# EAGLE design PCB-BI8-SE-C330 (EAGLE 6.4)
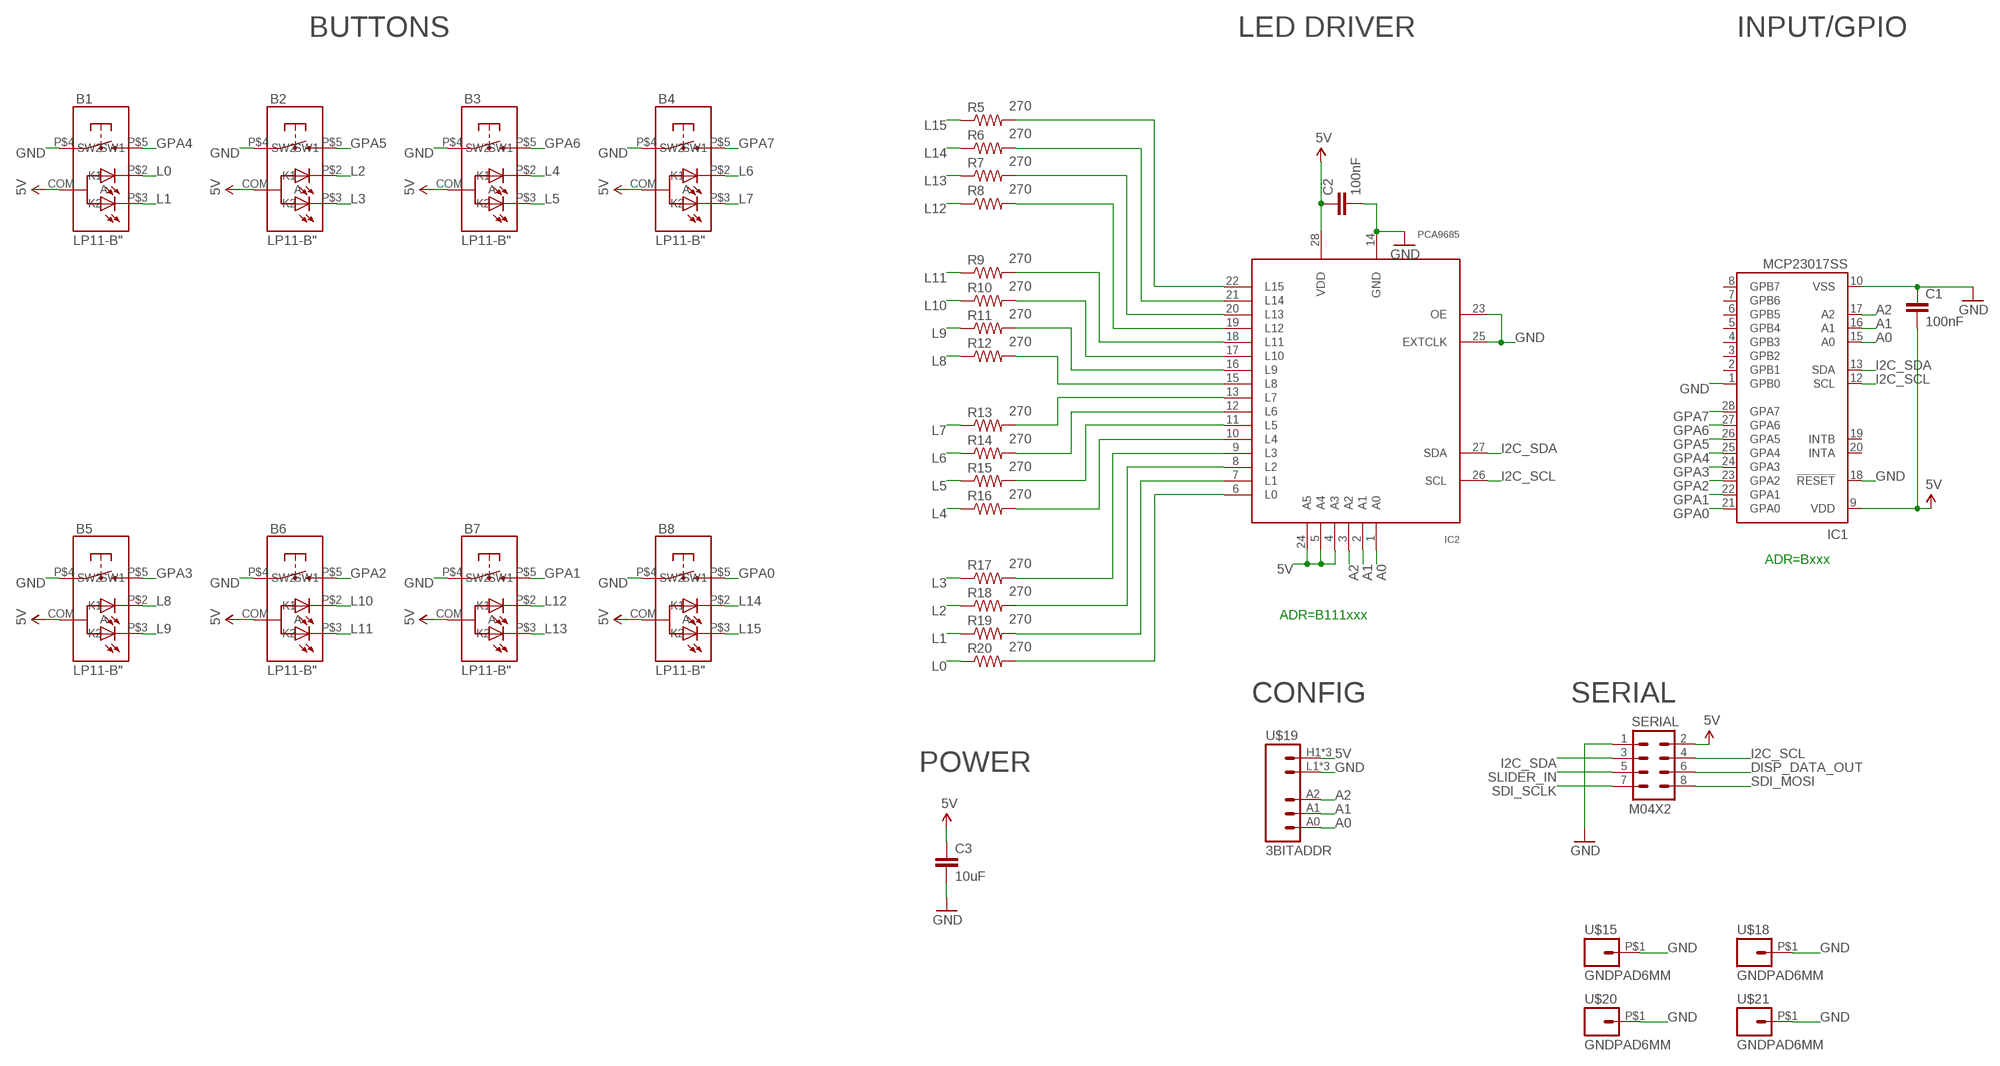
[diagram p0: schematic, sheet 1]

## Parts
B1  LP11-B"  [LP11]
B2  LP11-B"  [LP11]
B3  LP11-B"  [LP11]
B4  LP11-B"  [LP11]
B5  LP11-B"  [LP11]
B6  LP11-B"  [LP11]
B7  LP11-B"  [LP11]
B8  LP11-B"  [LP11]
C1  100nF  CAP0603-CAP  [0603-CAP]
C2  100nF  CAP0603-CAP  [0603-CAP]
C3  10uF  CAP0805  [0805]
IC1  MCP23017SS  [SSOP28]
IC2  PCA9685  [TSSOP28]
R5  270  RESISTOR0603-RES  [0603-RES]
R6  270  RESISTOR0603-RES  [0603-RES]
R7  270  RESISTOR0603-RES  [0603-RES]
R8  270  RESISTOR0603-RES  [0603-RES]
R9  270  RESISTOR0603-RES  [0603-RES]
R10  270  RESISTOR0603-RES  [0603-RES]
R11  270  RESISTOR0603-RES  [0603-RES]
R12  270  RESISTOR0603-RES  [0603-RES]
R13  270  RESISTOR0603-RES  [0603-RES]
R14  270  RESISTOR0603-RES  [0603-RES]
R15  270  RESISTOR0603-RES  [0603-RES]
R16  270  RESISTOR0603-RES  [0603-RES]
R17  270  RESISTOR0603-RES  [0603-RES]
R18  270  RESISTOR0603-RES  [0603-RES]
R19  270  RESISTOR0603-RES  [0603-RES]
R20  270  RESISTOR0603-RES  [0603-RES]
SERIAL  M04X2  [2X4]
U$15  GNDPAD6MM  [3.2MMPAD6MM]
U$18  GNDPAD6MM  [3.2MMPAD6MM]
U$19  3BITADDR  [3BITADDR]
U$20  GNDPAD6MM  [3.2MMPAD6MM]
U$21  GNDPAD6MM  [3.2MMPAD6MM]

## Nets
5V [Power]: B1.COM(A) B2.COM(A) B3.COM(A) B4.COM(A) B5.COM(A) B6.COM(A) B7.COM(A) B8.COM(A) C1.2 C2.1 C3.1 IC1.9(VDD) IC2.4(A3) IC2.5(A4) IC2.24(A5) IC2.28(VDD) SERIAL.2 U$19.H1(VCC) U$19.H2(VCC) U$19.H3(VCC)
A0: IC1.15(A0) IC2.1(A0) U$19.A0
A1: IC1.16(A1) IC2.2(A1) U$19.A1
A2: IC1.17(A2) IC2.3(A2) U$19.A2
DISP_DATA_OUT: SERIAL.6
GND [Power]: B1.P$4(SW1) B2.P$4(SW1) B3.P$4(SW1) B4.P$4(SW1) B5.P$4(SW1) B6.P$4(SW1) B7.P$4(SW1) B8.P$4(SW1) C1.1 C2.2 C3.2 IC1.1(GPB0) IC1.10(VSS) IC1.18(!RESET) IC2.14(GND) IC2.23(OE) IC2.25(EXTCLK) SERIAL.1 U$15.P$1 U$18.P$1 U$19.L1(GND) U$19.L2(GND) U$19.L3(GND) U$20.P$1 U$21.P$1
GPA0: B8.P$5(SW2) IC1.21(GPA0)
GPA1: B7.P$5(SW2) IC1.22(GPA1)
GPA2: B6.P$5(SW2) IC1.23(GPA2)
GPA3: B5.P$5(SW2) IC1.24(GPA3)
GPA4: B1.P$5(SW2) IC1.25(GPA4)
GPA5: B2.P$5(SW2) IC1.26(GPA5)
GPA6: B3.P$5(SW2) IC1.27(GPA6)
GPA7: B4.P$5(SW2) IC1.28(GPA7)
I2C_SCL: IC1.12(SCL) IC2.26(SCL) SERIAL.4
I2C_SDA: IC1.13(SDA) IC2.27(SDA) SERIAL.3
L0: B1.P$2(K1) R20.1
L1: B1.P$3(K2) R19.1
L2: B2.P$2(K1) R18.1
L3: B2.P$3(K2) R17.1
L4: B3.P$2(K1) R16.1
L5: B3.P$3(K2) R15.1
L6: B4.P$2(K1) R14.1
L7: B4.P$3(K2) R13.1
L8: B5.P$2(K1) R12.1
L9: B5.P$3(K2) R11.1
L10: B6.P$2(K1) R10.1
L11: B6.P$3(K2) R9.1
L12: B7.P$2(K1) R8.1
L13: B7.P$3(K2) R7.1
L14: B8.P$2(K1) R6.1
L15: B8.P$3(K2) R5.1
N$4: IC2.13(L7) R13.2
N$5: IC2.12(L6) R14.2
N$7: IC2.11(L5) R15.2
N$9: IC2.10(L4) R16.2
N$10: IC2.9(L3) R17.2
N$11: IC2.8(L2) R18.2
N$12: IC2.7(L1) R19.2
N$19: IC2.6(L0) R20.2
N$20: IC2.15(L8) R12.2
N$21: IC2.16(L9) R11.2
N$22: IC2.17(L10) R10.2
N$23: IC2.18(L11) R9.2
N$24: IC2.19(L12) R8.2
N$25: IC2.20(L13) R7.2
N$26: IC2.21(L14) R6.2
N$27: IC2.22(L15) R5.2
SDI_MOSI: SERIAL.8
SDI_SCLK: SERIAL.7
SLIDER_IN: SERIAL.5
Unconnected: IC1.2(GPB1) IC1.3(GPB2) IC1.4(GPB3) IC1.5(GPB4) IC1.6(GPB5) IC1.7(GPB6) IC1.8(GPB7) IC1.19(INTB) IC1.20(INTA)

## Notes on the sheet
- BUTTONS | LED DRIVER | INPUT/GPIO
- ADR=Bxxx
- ADR=B111xxx
- CONFIG | SERIAL
- POWER

## Library data of the parts
B1-B8 = SKAARHOJ:LP11-B
C1-C3 = SparkFun:CAP: Capacitor Standard 0603 ceramic capacitor, and 0.1" leaded capacitor.
IC1 = microchip:MCP23017: http://ww1.microchip.com/downloads/en/DeviceDoc/21952a.pdf Source: http://ww1.microchip.com/downloads/en/DeviceDoc/21952a.pdf; MF: MICROCHIP; MPN: MCP23017-E/SS; OC_FARNELL: 1467674; OC_NEWARK: 31K2960
IC2 = wsmith:PCA9685
R5-R20 = SparkFun:RESISTOR: Resistor Basic schematic elements and footprints for 0603, 1206, and PTH resistors.
SERIAL = SparkFun:M04X2
U$15 U$18 U$20 U$21 = SKAARHOJ:GNDPAD
U$19 = SKAARHOJ:3BITADDR

## Net classes
0 default: width 0.203 mm, drill 0.406 mm, clearance 0.203 mm
1 Power: width 0.406 mm, drill 0.61 mm, clearance 0.203 mm

## Board
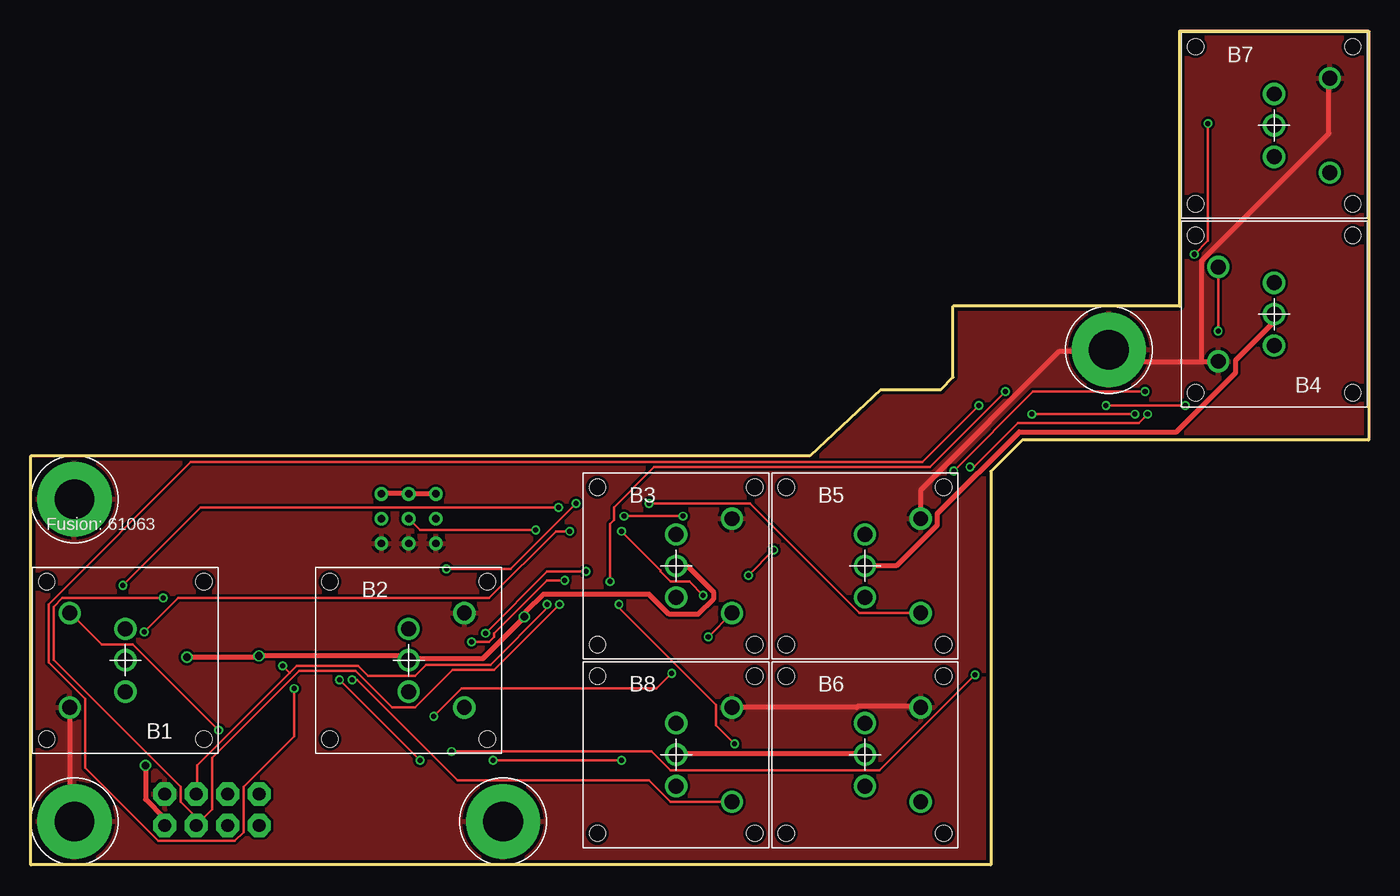
[diagram p1: board, top side]
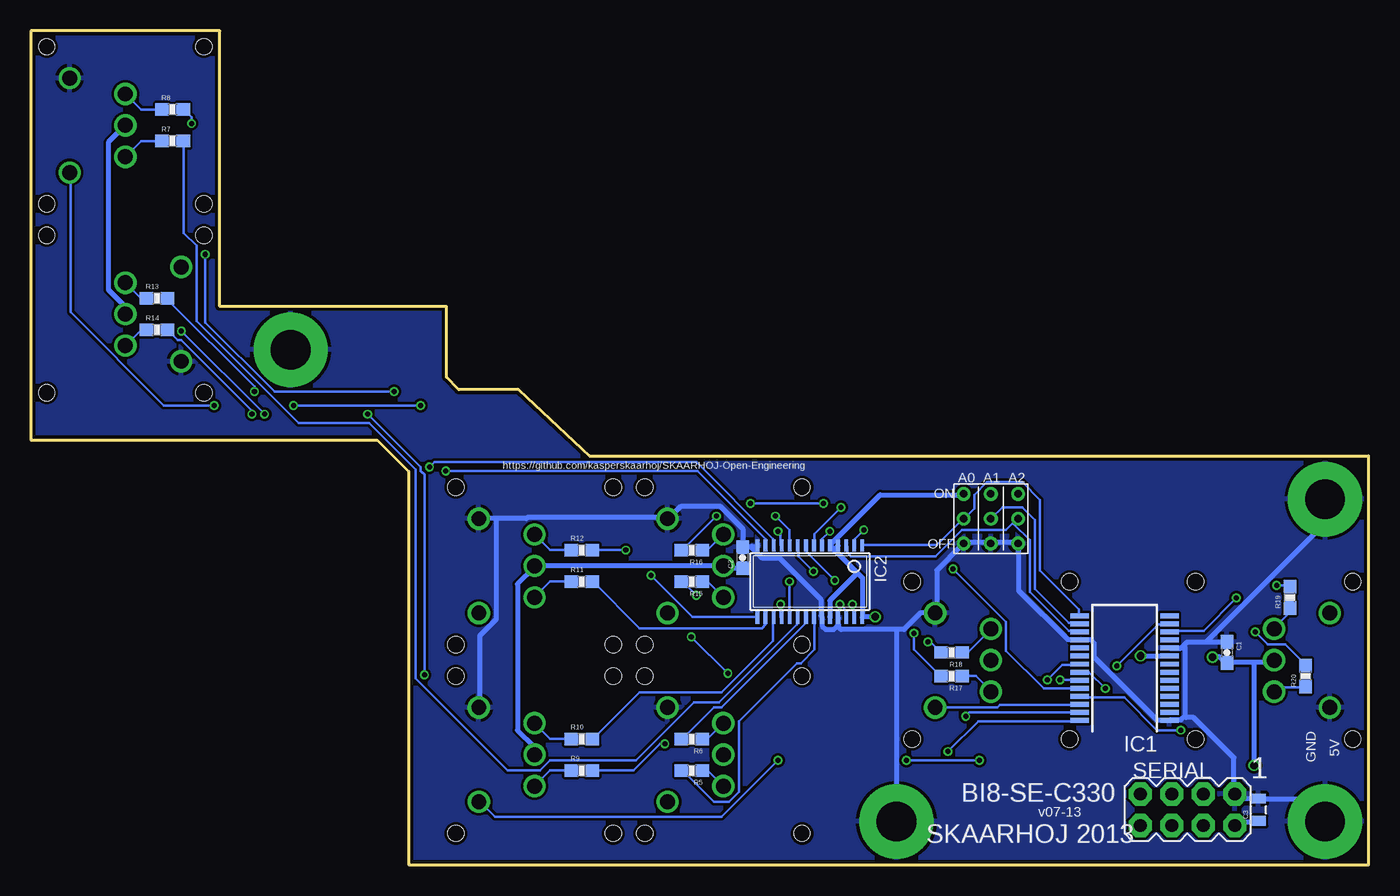
[diagram p2: board, bottom side, seen from below]

Size 107.95 x 67.31 mm. Coordinates in mm from the lower left corner, seen from the top.
Outline: 0,0 0,33.02 62.87,33.02 68.58,38.35 73.43,38.35 74.42,39.37 74.42,45.09 92.71,45.09 92.71,67.31 107.95,67.31 107.95,34.29 80.01,34.29 77.47,31.75 77.47,0 0,0
Copper layers (1*16): Top 0.035mm / dielectric 1.5mm / Bottom 0.035mm
Design rules "Fusion_eagle_rule_v1.1": minimum track width 6mil, minimum drill 12mil, track to track 6mil, track to pad 6mil, pad to pad 6mil, via to via 6mil, smd to smd 0mil, copper to edge 10mil, drill to drill 10mil, minimum pad ring 10mil, minimum via ring 6mil, stop-mask expansion 2mil, vias tented up to drill 100mil, thermal gap 10mil

### Footprints (pad centres in the part's own frame; a part is rotated, then mirrored left to right if it is on the bottom)
LP11 = drill 1.2: COM 0,0; P$2 0,2.54; P$3 0,-2.54; P$4 4.5,3.81; P$5 4.5,-3.81 | hole 1.3: -6.35,6.35; 6.35,6.35; 6.35,-6.35; -6.35,-6.35
0603-CAP = smd 1.1 x 1: 1 -0.85,0; 2 0.85,0
0805 = smd 0.8 x 1.2: 1 -0.9,0; 2 0.9,0
SSOP28 = smd 0.4 x 1.5: 1 -4.225,-3.625; 2 -3.575,-3.625; 3 -2.925,-3.625; 4 -2.275,-3.625; 5 -1.625,-3.625; 6 -0.975,-3.625; 7 -0.325,-3.625; 8 0.325,-3.625; 9 0.975,-3.625; 10 1.625,-3.625; 11 2.275,-3.625; 12 2.925,-3.625; 13 3.575,-3.625; 14 4.225,-3.625; 15 4.225,3.625; 16 3.575,3.625; 17 2.925,3.625; 18 2.275,3.625; 19 1.625,3.625; 20 0.975,3.625; 21 0.325,3.625; 22 -0.325,3.625; 23 -0.975,3.625; 24 -1.625,3.625; 25 -2.275,3.625; 26 -2.925,3.625; 27 -3.575,3.625; 28 -4.225,3.625
TSSOP28 = smd 0.305 x 0.991: 1 -4.225,-2.918; 2 -3.575,-2.918; 3 -2.925,-2.918; 4 -2.275,-2.918; 5 -1.625,-2.918; 6 -0.975,-2.918; 7 -0.325,-2.918; 8 0.325,-2.918; 9 0.975,-2.918; 10 1.625,-2.918; 11 2.275,-2.918; 12 2.925,-2.918; 13 3.575,-2.918; 14 4.225,-2.918; 15 4.225,2.918; 16 3.575,2.918; 17 2.925,2.918; 18 2.275,2.918; 19 1.625,2.918; 20 0.975,2.918; 21 0.325,2.918; 22 -0.325,2.918; 23 -0.975,2.918; 24 -1.625,2.918; 25 -2.275,2.918; 26 -2.925,2.918; 27 -3.575,2.918; 28 -4.225,2.918
0603-RES = smd 1.1 x 1: 1 -0.85,0; 2 0.85,0
2X4 = drill 1.016 pad 1.88 octagon: 1 -3.81,-1.27; 2 -3.81,1.27; 3 -1.27,-1.27; 4 -1.27,1.27; 5 1.27,-1.27; 6 1.27,1.27; 7 3.81,-1.27; 8 3.81,1.27
3.2MMPAD6MM = drill 3.2 pad 6: P$1 0,0
3BITADDR = drill 0.6: A0 -2.2,0; A1 0,0; A2 2.2,0; H1 -2.2,2; H2 0,2; H3 2.2,2; L1 -2.2,-2; L2 0,-2; L3 2.2,-2

### Placement (x,y rotation side)
B1  7.62,16.51 180 top
B2  30.48,16.51 0 top
B3  52.07,24.13 0 top
B4  100.33,44.45 180 top
B5  67.31,24.13 0 top
B6  67.31,8.89 0 top
B7  100.33,59.69 0 top
B8  52.07,8.89 0 top
C1  11.43,17.14 270 bottom
C2  50.52,24.79 90 bottom
C3  8.89,4.45 90 bottom
IC1  19.68,15.88 90 bottom
IC2  45.09,22.86 180 bottom
R5  54.61,7.62 180 bottom
R6  54.61,10.16 180 bottom
R7  96.52,58.42 0 bottom
R8  96.52,60.96 0 bottom
R9  63.5,7.62 0 bottom
R10  63.5,10.16 0 bottom
R11  63.5,22.86 0 bottom
R12  63.5,25.4 0 bottom
R13  97.79,45.72 0 bottom
R14  97.79,43.18 0 bottom
R15  54.61,22.86 180 bottom
R16  54.61,25.4 180 bottom
R17  33.66,15.24 180 bottom
R18  33.66,17.14 180 bottom
R19  6.35,21.59 90 bottom
R20  5.08,15.24 90 bottom
SERIAL  14.61,4.45 180 bottom
U$15  3.5,29.52 0 top
U$18  38.1,3.5 0 top
U$19  30.48,27.94 0 bottom
U$20  3.5,3.5 0 top
U$21  87,41.59 0 top

### Tracks (layer width: path | path; a pad name or v marks a point on that pad's centre or on a via)
5V  (via drill 0.61)
  Top 0.406: U$19.H3 28.35,29.97 30.48,29.97 U$19.H2 30.58,29.97 32.61,29.97 U$19.H1 | v9.25,8.03 9.25,5.28 10.77,3.76 10.77,3.25 SERIAL.2 | v12.6,16.76 18.29,16.76 v18.39,16.87 30.18,16.87 30.48,16.56 B2.COM 30.58,16.66 36.47,16.66 v39.83,20.02 39.93,20.12 39.93,20.42 41.35,21.84 49.89,21.84 51.51,20.22 53.85,20.22 55.07,21.44 55.07,22.05 53.03,24.08 52.12,24.08 B3.COM | B8.COM 52.12,8.94 67.26,8.94 B6.COM | B4.COM 100.28,44.4 100.28,43.79 97.23,40.74 97.23,39.73 92.46,34.95 79.76,34.95 73.15,28.35 73.15,27.43 69.9,24.18 67.36,24.18 B5.COM
  Bottom 0.406: 40.84,20.02 40.84,23.16 41.25,23.57 | 43.13,25.45 43.38,25.7 IC2.5 43.38,25.91 39.42,29.87 32.72,29.87 U$19.H1 | 43.13,25.45 41.25,23.57 | 40.84,20.02 IC2.28 | 43.13,25.45 42.88,25.7 IC2.4 | 41.25,23.57 43.48,21.34 43.48,20.02 IC2.24 | v18.39,16.87 16.15,16.87 IC1.9 | C3.1 8.94,3.45 10.57,3.45 10.77,3.25 SERIAL.2 | 9.25,16.36 7.72,16.36 7.62,16.46 B1.COM | 9.25,16.36 11.38,16.36 C1.2 11.58,16.36 11.99,16.76 v12.6,16.76 | 9.25,16.36 v9.25,8.03 | v39.83,20.02 40.84,20.02 | B7.COM 101.7,58.32 101.7,46.43 100.38,45.11 100.38,44.5 B4.COM | C2.1 50.6,23.98 51.92,23.98 B3.COM 52.22,24.18 67.26,24.18 B5.COM 67.36,23.98 68.68,22.66 68.68,10.87 67.36,9.55 67.36,8.94 B6.COM
A0
  Bottom 0.203: IC2.1 40.84,25.81 34.85,25.81 32.72,27.94 U$19.A0 32.61,27.94 31.8,28.75 31.8,29.87 30.79,30.89 27.94,30.89 26.52,29.46 26.52,23.77 23.37,20.62 23.37,20.12 IC1.15
A1  (via drill 0.41)
  Top 0.203: v40.74,27.03 31.39,27.03 U$19.A1
  Bottom 0.203: v40.74,27.03 41.45,26.31 41.45,25.81 IC2.2 | U$19.A1 29.57,28.85 27.94,28.85 26.92,27.84 26.92,22.25 24.18,19.51 23.37,19.51 IC1.16
A2
  Bottom 0.203: IC2.3 42.06,25.7 42.06,25.2 41.76,24.89 34.95,24.89 32.82,27.03 29.26,27.03 28.35,27.94 U$19.A2 28.65,27.53 27.33,26.21 27.33,22.05 24.18,18.9 23.37,18.9 IC1.17
GND
  Top 0.406: B1.P$4 3.15,12.7 3.15,3.86 3.45,3.56 U$20.P$1 | 94.49,40.64 87.99,40.64 87.07,41.55 U$21.P$1 86.87,41.45 83.01,41.45 71.83,30.28 71.83,27.94 B5.P$4 | 94.49,40.64 B4.P$4 | 94.49,40.64 94.49,48.77 104.75,59.03 104.75,63.5 B7.P$4 | B8.P$4 66.65,12.7 66.75,12.8 71.63,12.8 71.73,12.7 B6.P$4
  Bottom 0.406: 13.01,17.98 14.63,17.98 14.94,17.68 | 13.01,17.98 11.48,17.98 C1.1 | 14.94,17.68 15.14,17.48 16.05,17.48 IC1.10 | 14.83,11.99 15.14,11.68 16.05,11.68 IC1.1 16.26,11.68 17.07,11.68 22.15,16.76 22.15,17.88 22.45,18.19 23.16,18.19 IC1.18 23.37,18.19 24.28,18.19 28.25,22.15 28.25,25.91 U$19.L3 28.45,26.01 30.48,26.01 U$19.L2 30.58,26.01 32.61,26.01 U$19.L1 32.82,25.81 34.85,23.77 34.85,20.42 B2.P$4 36.17,20.32 37.49,19 38.1,19 | 14.83,11.99 14.83,17.58 14.94,17.68 | U$20.P$1 5.28,5.28 8.74,5.28 C3.2 8.94,5.38 10.46,5.38 SERIAL.1 10.87,5.89 10.87,8.64 14.12,11.89 14.73,11.89 14.83,11.99 | U$15.P$1 3.56,29.46 3.56,27.53 13.01,18.09 13.01,17.98 | 42.88,19.3 43.18,19 43.79,19 44.09,19.3 44.09,19.91 IC2.23 44.2,20.12 44.2,21.44 47.55,24.79 48.97,24.79 49.78,25.6 49.78,25.7 | 42.88,19.3 42.77,19.41 42.77,19.91 IC2.25 | 42.88,19.3 42.57,19 38.1,19 | 49.78,25.7 50.49,25.7 C2.2 50.49,25.91 50.49,27.13 52.32,28.96 55.47,28.96 56.49,27.94 B3.P$4 56.69,28.04 67.87,28.04 67.97,27.94 70.41,27.94 | 49.78,25.7 49.38,25.7 IC2.14 | 70.41,27.94 B5.P$4 | 70.41,27.94 70.41,19.81 71.73,18.49 71.73,12.7 B6.P$4 | 38.1,19 U$18.P$1
  pour Top: 0,0 107.95,0 107.95,67.31 0,67.31
  pour Bottom: 0,0 107.95,0 107.95,67.31 0,67.31
GPA0  (via drill 0.41)
  Top 0.203: v25.91,14.94 26.31,14.94 34.44,6.81 49.89,6.81 51.61,5.08 B8.P$5
  Bottom 0.203: v25.91,14.94 24.69,16.15 23.37,16.15 IC1.21
GPA1  (via drill 0.41)
  Top 0.203: v21.23,14.22 21.23,10.36 17.17,6.3 17.17,2.64 16.46,1.93 10.26,1.93 4.37,7.82 4.37,13.41 1.42,16.36 1.42,21.03 12.9,32.51 71.93,32.51 v76.5,37.08 | v93.17,37.08 v86.77,37.08
  Bottom 0.203: v21.23,14.22 22.55,15.54 23.27,15.54 IC1.22 | v86.77,37.08 v76.5,37.08 | v93.17,37.08 97.23,37.08 104.75,44.6 104.75,55.88 B7.P$5
GPA2  (via drill 0.41)
  Top 0.203: v31.39,8.43 v24.89,14.94 | v47.65,8.43 v37.29,8.43
  Bottom 0.203: v24.89,14.94 23.37,14.94 IC1.23 | v37.29,8.43 v31.39,8.43 | v47.65,8.43 52.22,3.86 70.51,3.86 71.73,5.08 B6.P$5
GPA3  (via drill 0.41)
  Top 0.203: v33.53,23.88 38.71,23.88 v43.99,29.16 | v49.89,29.16 58.01,29.16 66.85,20.32 B5.P$5
  Bottom 0.203: v33.53,23.88 29.26,19.61 29.26,17.27 26.21,14.22 23.37,14.22 IC1.24 | v49.89,29.16 v43.99,29.16
GPA4  (via drill 0.41)
  Top 0.203: v15.14,10.87 8.23,17.78 5.69,17.78 3.15,20.32 B1.P$5
  Bottom 0.203: v15.14,10.87 17.07,10.87 19.71,13.51 23.27,13.51 IC1.25
GPA5
  Bottom 0.203: B2.P$5 29.97,12.7 29.77,12.9 23.37,12.9 IC1.26
GPA6  (via drill 0.41)
  Top 0.203: v32.51,11.99 34.75,14.22 50.49,14.22 v51.71,15.44 | v54.66,18.39 56.59,20.32 B3.P$5
  Bottom 0.203: v32.51,11.99 32.21,12.29 23.37,12.29 IC1.27 | v54.66,18.39 v51.71,15.44
GPA7  (via drill 0.41)
  Top 0.203: v33.93,9.14 50.09,9.14 51.61,7.62 68.48,7.62 v76.2,15.34 | v89.1,36.37 v80.77,36.37 | v95.81,43.08 95.81,48.26 B4.P$5
  Bottom 0.203: v33.93,9.14 31.5,11.58 23.37,11.58 IC1.28 | v76.2,15.34 76.2,31.5 76.5,31.8 76.5,32.11 v80.77,36.37 | v95.81,43.08 v89.1,36.37
I2C_SCL  (via drill 0.41)
  Top 0.203: v42.67,21.03 37.39,15.75 34.04,15.75 30.99,12.7 29.16,12.7 26.21,15.65 21.64,15.65 14.63,8.64 14.63,4.47 SERIAL.4 13.61,3.56 12.09,5.08 12.09,6.3 1.83,16.56 1.83,20.83 2.54,21.54 v10.67,21.54
  Bottom 0.203: v42.67,21.03 42.16,20.52 42.16,20.02 IC2.26 | v10.67,21.54 13.31,18.9 16.05,18.9 IC1.12
I2C_SDA  (via drill 0.41)
  Top 0.203: v41.66,21.03 41.66,20.73 37.08,16.15 31.9,16.15 30.99,15.24 27.23,15.24 26.42,16.05 21.44,16.05 20.88,15.49 | 20.88,15.49 13.41,8.03 13.41,5.79 SERIAL.3 | 20.88,15.49 v20.32,16.05
  Bottom 0.203: v41.66,21.03 41.55,20.93 41.55,20.02 IC2.27 | v20.32,16.05 16.97,19.41 16.15,19.41 IC1.13
L0
  Bottom 0.203: R20.1 5.08,14.33 7.32,14.33 7.62,14.02 B1.P$2
L1
  Bottom 0.203: R19.1 6.4,20.73 6.4,20.32 7.62,19.1 B1.P$3
L2
  Bottom 0.203: R18.1 32.72,17.17 32.31,17.17 30.48,19 B2.P$2
L3
  Bottom 0.203: R17.1 31.7,15.24 30.48,14.02 B2.P$3
L4
  Bottom 0.203: R16.1 53.34,25.4 B3.P$2
L5
  Bottom 0.203: R15.1 53.34,22.86 B3.P$3
L6
  Bottom 0.203: R14.1 99.06,43.18 B4.P$2
L7
  Bottom 0.203: R13.1 99.06,45.72 B4.P$3
L8
  Bottom 0.203: R12.1 66.04,25.4 B5.P$2
L9
  Bottom 0.203: R11.1 66.04,22.86 B5.P$3
L10
  Bottom 0.203: R10.1 66.04,10.16 B6.P$2
L11
  Bottom 0.203: R9.1 66.04,7.62 B6.P$3
L12
  Bottom 0.203: R8.1 99.06,60.96 B7.P$2
L13
  Bottom 0.203: R7.1 99.06,58.42 B7.P$3
L14
  Bottom 0.203: R6.1 53.34,10.16 B8.P$2
L15
  Bottom 0.203: R5.1 53.34,7.62 B8.P$3
N$4  (via drill 0.41)
  Top 0.203: v74.47,31.8 80.87,38.2 v89.92,38.2
  Bottom 0.203: v74.47,31.8 54.15,31.8 48.67,26.31 48.67,25.81 IC2.13 | v89.92,38.2 89.92,38.61 97.03,45.72 R13.2
N$5  (via drill 0.41)
  Top 0.203: v75.79,32.11 76.1,32.11 79.65,35.66 89.41,35.66 v90.12,36.37
  Bottom 0.203: v75.79,32.11 75.39,32.51 54.25,32.51 48.06,26.31 48.06,25.81 IC2.12 | v90.12,36.37 90.12,36.68 95.81,42.37 96.11,42.37 96.93,43.18 R14.2
N$7  (via drill 0.41)
  Top 0.203: v47.65,26.92 50.8,23.77 50.8,23.67 51.61,22.86 53.14,22.86 v54.25,21.74
  Bottom 0.203: v47.65,26.92 47.45,26.72 47.45,25.81 IC2.11 | v54.25,21.74 55.37,22.86 R15.2
N$9  (via drill 0.41)
  Top 0.203: v52.63,28.14 v47.85,28.14
  Bottom 0.203: v47.85,28.14 46.74,27.03 46.74,25.81 IC2.10 | v52.63,28.14 55.37,25.4 R16.2
N$10  (via drill 0.41)
  Top 0.203: v44.81,23.67 41.66,23.67 v36.68,18.69
  Bottom 0.203: v44.81,23.67 46.02,24.89 46.02,25.7 IC2.9 | v36.68,18.69 36.68,17.37 34.54,15.24 R17.2
N$11  (via drill 0.41)
  Top 0.203: v43.08,22.96 41.66,22.96 37.39,18.69 37.39,18.39 36.98,17.98 v35.56,17.98
  Bottom 0.203: v43.08,22.96 45.31,25.2 45.31,25.7 IC2.8 | v35.56,17.98 35.36,17.98 34.54,17.17 R18.2
N$12  (via drill 0.41)
  Top 0.203: v42.57,28.85 13.72,28.85 v7.42,22.55
  Bottom 0.203: v42.57,28.85 44.7,26.72 44.7,25.81 IC2.7 | v7.42,22.55 6.5,22.55 6.4,22.45 R19.2
N$19  (via drill 0.41)
  Top 0.203: v43.48,26.92 42.37,26.92 36.98,21.54 11.89,21.54 v9.14,18.8
  Bottom 0.203: v43.48,26.92 44.09,26.31 44.09,25.81 IC2.6 | v9.14,18.8 8.13,17.78 6.71,17.78 5.08,16.15 R20.2
N$20  (via drill 0.41)
  Top 0.203: v59.94,25.4 v57.91,23.37
  Bottom 0.203: v57.91,23.37 54.56,20.02 49.38,20.02 IC2.15 | R12.2 v59.94,25.4
N$21
  Bottom 0.203: IC2.16 48.67,19.91 48.67,19.41 48.97,19.1 58.83,19.1 62.59,22.86 R11.2
N$22
  Bottom 0.203: IC2.17 48.06,19.91 48.06,18.09 52.22,13.92 58.83,13.92 62.59,10.16 R10.2
N$23  (via drill 0.41)
  Top 0.203: v47.45,21.03 47.45,20.73 55.27,12.9 55.27,11.28 v56.79,9.75
  Bottom 0.203: v47.45,21.03 47.45,20.02 IC2.18 | v56.79,9.75 57.2,9.75 59.33,7.62 R9.2
N$24  (via drill 0.41)
  Top 0.203: v46.74,22.86 46.74,27.53 47.04,27.84 47.04,28.85 50.29,32.11 72.54,32.11 v78.64,38.2 | v93.88,49.28 95,50.39 v95,59.84
  Bottom 0.203: v46.74,22.86 46.74,20.02 IC2.19 | v78.64,38.2 88.29,38.2 93.88,43.79 v93.88,49.28 | v95,59.84 95,60.35 95.61,60.96 R8.2
N$25
  Bottom 0.203: IC2.20 46.13,19.91 46.13,19.41 52.43,13.11 54.46,13.11 59.13,8.43 66.04,8.43 66.85,7.62 69.49,7.62 76.91,15.04 76.91,31.9 80.67,35.66 86.36,35.66 94.59,43.89 94.59,49.99 95.61,51 95.61,58.42 R7.2
N$26
  Bottom 0.203: IC2.21 45.41,19.91 45.41,19.51 52.22,12.7 52.83,12.7 55.37,10.16 R6.2
N$27
  Bottom 0.203: IC2.22 44.7,19.91 44.7,17.37 45.82,16.26 46.13,16.26 50.8,11.58 50.8,5.89 51.61,5.08 52.83,5.08 55.37,7.62 R5.2

### Text on the board
_tsilk: Fusion: 61063
_bsilk: https://github.com/kasperskaarhoj/SKAARHOJ-Open-Engineering | GND | 5V | 1 | BI8-SE-C330 | v07-13 | SKAARHOJ 2013